# EAGLE schematic Anchor PCB V1 (EAGLE 9.2.0)
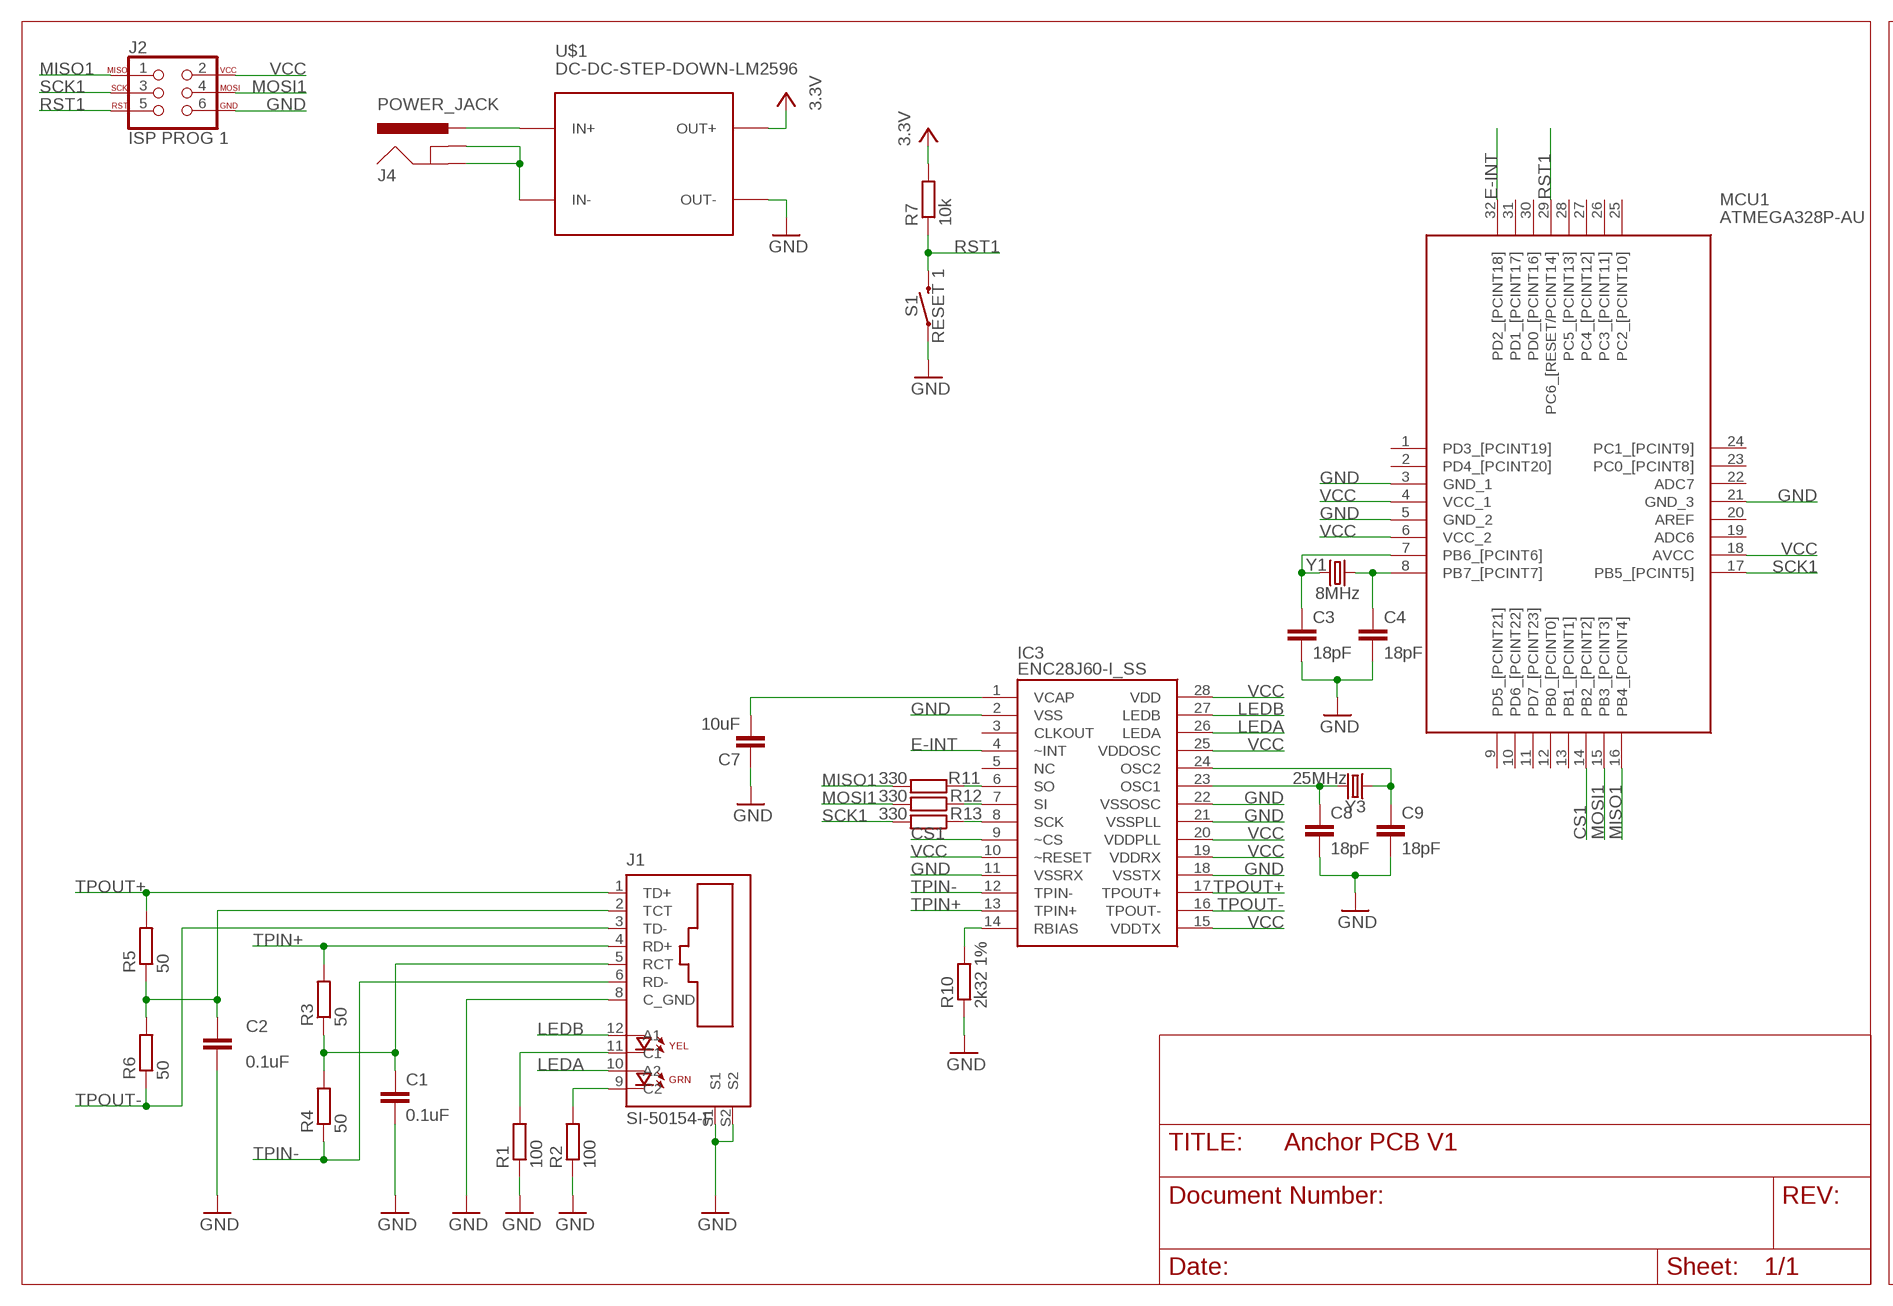
[diagram p0: schematic, sheet 1, part 1 of 2]
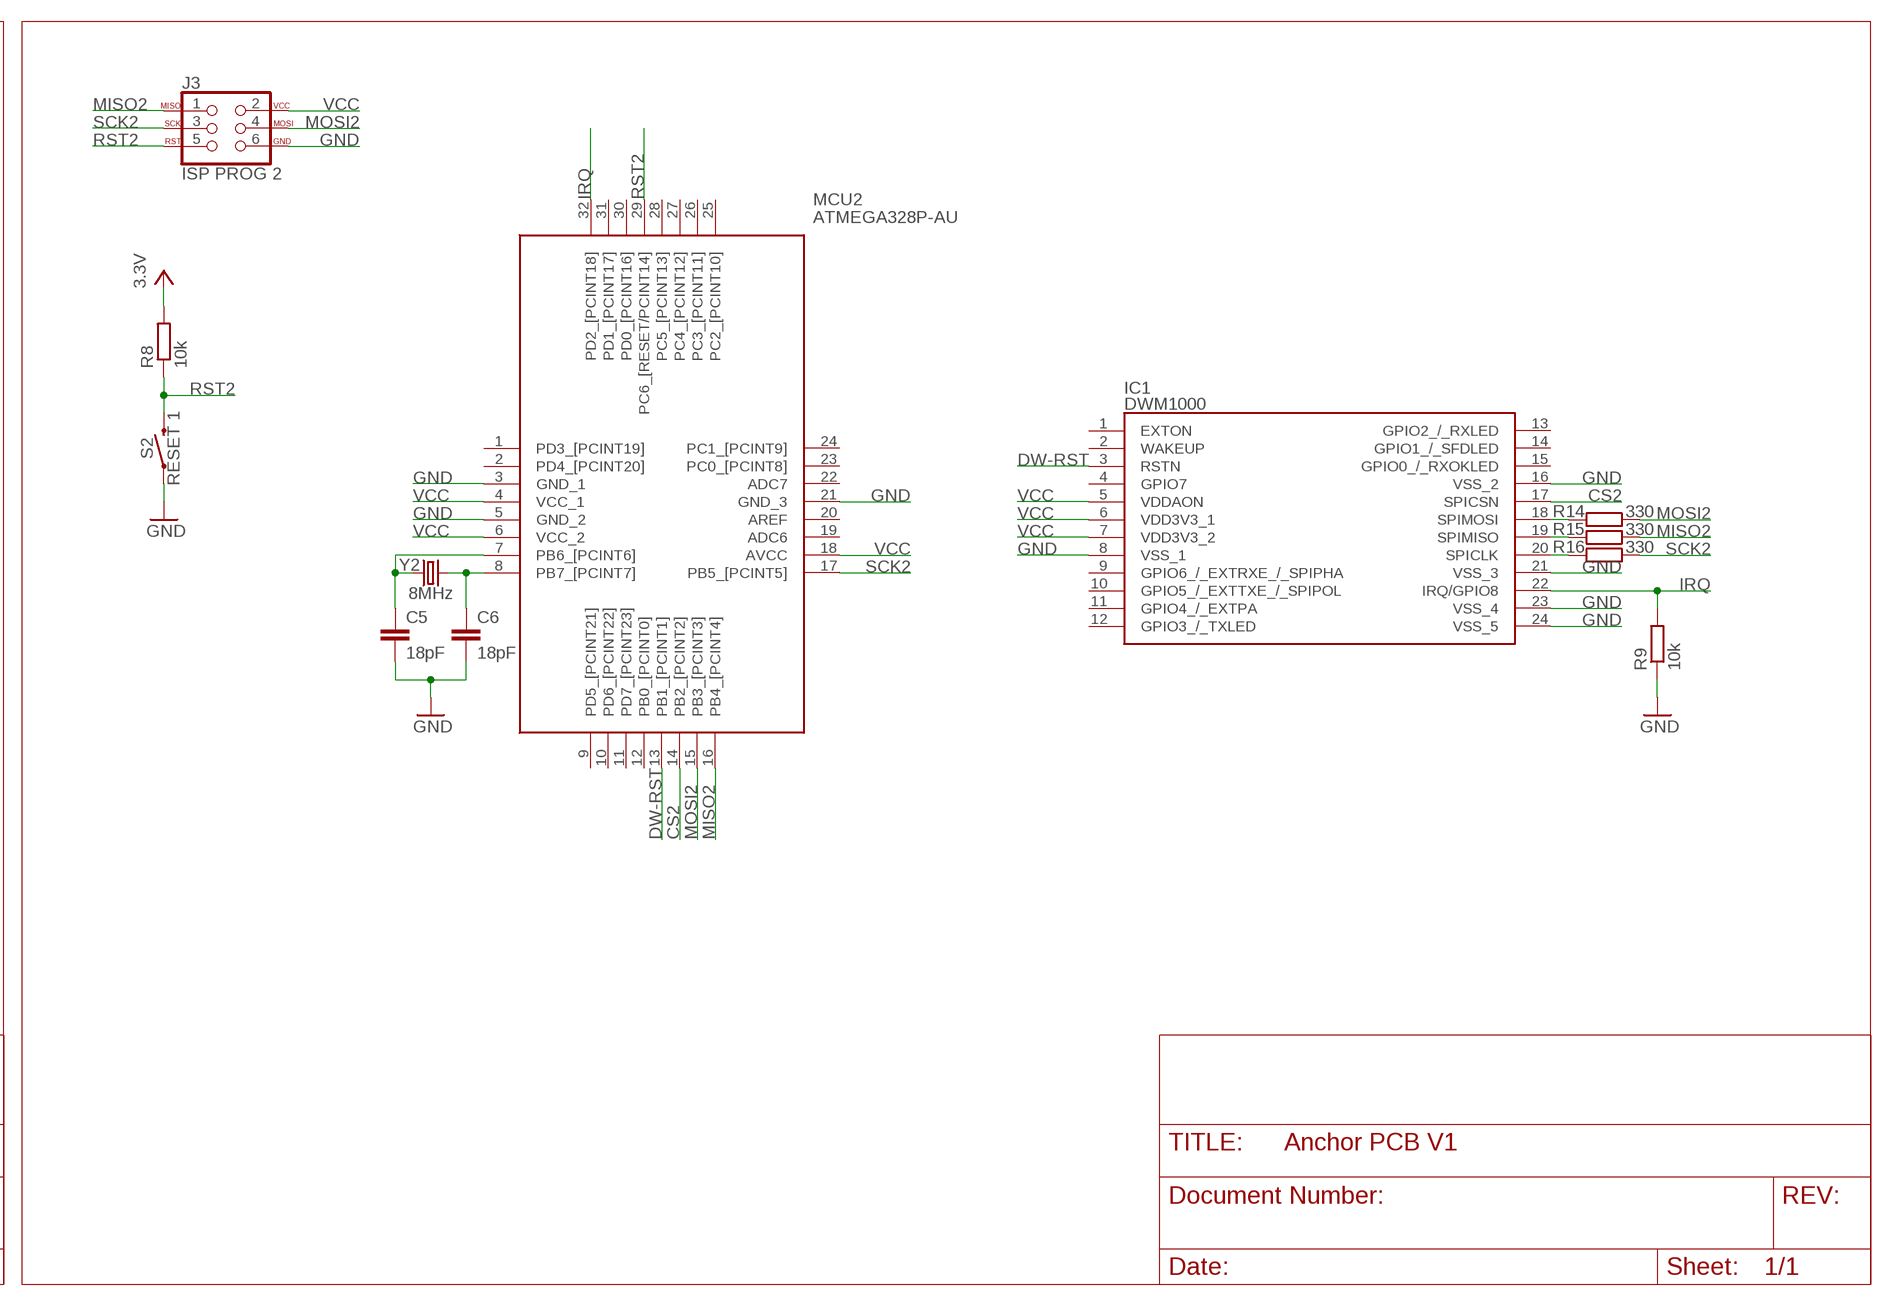
[diagram p1: schematic, sheet 1, part 2 of 2]

## Parts
C1  0.1uF  C-EUC1206  [C1206]
C2  0.1uF  C-EUC1206  [C1206]
C3  18pF  C-EUC1206  [C1206]
C4  18pF  C-EUC1206  [C1206]
C5  18pF  C-EUC1206  [C1206]
C6  18pF  C-EUC1206  [C1206]
C7  10uF  C-EUC1206  [C1206]
C8  18pF  C-EUC1206  [C1206]
C9  18pF  C-EUC1206  [C1206]
IC1  DWM1000  [DWM1000]
IC3  ENC28J60-I_SS  [SOP65P780X200-28N]
J1  SI-50154-F  [STEWART_SI-50154-F]
J2  ISP PROG 1  AVR_SPI_PROG_3X2PTH  [2X3]
J3  ISP PROG 2  AVR_SPI_PROG_3X2PTH  [2X3]
J4  POWER_JACK  [POWER_JACK_PTH]
MCU1  ATMEGA328P-AU  [QFP80P900X900X120-32N]
MCU2  ATMEGA328P-AU  [QFP80P900X900X120-32N]
R1  100  R-EU_R1206  [R1206]
R2  100  R-EU_R1206  [R1206]
R3  50  R-EU_R1206  [R1206]
R4  50  R-EU_R1206  [R1206]
R5  50  R-EU_R1206  [R1206]
R6  50  R-EU_R1206  [R1206]
R7  10k  R-EU_R1206  [R1206]
R8  10k  R-EU_R1206  [R1206]
R9  10k  R-EU_R1206  [R1206]
R10  2k32 1%  R-EU_R1206  [R1206]
R11  330  R-EU_R1206  [R1206]
R12  330  R-EU_R1206  [R1206]
R13  330  R-EU_R1206  [R1206]
R14  330  R-EU_R1206  [R1206]
R15  330  R-EU_R1206  [R1206]
R16  330  R-EU_R1206  [R1206]
S1  RESET 1  MOMENTARY-SWITCH-SPST-PTH-6.0MM  [TACTILE_SWITCH_PTH_6.0MM]
S2  RESET 1  MOMENTARY-SWITCH-SPST-PTH-6.0MM  [TACTILE_SWITCH_PTH_6.0MM]
U$1  DC-DC-STEP-DOWN-LM2596  [DC-DC-STEP-DOWN-LM2596]
Y1  8MHz  CRYSTALPTH-HC49US  [HC49US]
Y2  8MHz  CRYSTALPTH-HC49US  [HC49US]
Y3  25MHz  CRYSTALPTH-HC49US  [HC49US]

## Nets
CS1: IC3.9(~CS) MCU1.14(PB2_[PCINT2])
CS2: IC1.17(SPICSN) MCU2.14(PB2_[PCINT2])
DW-RST: IC1.3(RSTN) MCU2.13(PB1_[PCINT1])
E-INT: IC3.4(~INT) MCU1.32(PD2_[PCINT18])
GND: C1.2 C2.2 C3.2 C4.2 C5.2 C6.2 C7.1 C8.2 C9.2 IC1.8(VSS_1) IC1.16(VSS_2) IC1.21(VSS_3) IC1.23(VSS_4) IC1.24(VSS_5) IC3.2(VSS) IC3.11(VSSRX) IC3.18(VSSTX) IC3.21(VSSPLL) IC3.22(VSSOSC) J1.8(C_GND) J1.S1 J1.S2 J2.6 J3.6 MCU1.3(GND_1) MCU1.5(GND_2) MCU1.21(GND_3) MCU2.3(GND_1) MCU2.5(GND_2) MCU2.21(GND_3) R1.1 R2.1 R9.1 R10.1 S1.1 S2.1 U$1.OUT-
IN+: J4.PWR U$1.IN+
IN-: J4.GND J4.GNDBREAK U$1.IN-
IRQ: IC1.22(IRQ/GPIO8) MCU2.32(PD2_[PCINT18]) R9.2
LEDA: IC3.26(LEDA) J1.10(A2)
LEDB: IC3.27(LEDB) J1.12(A1)
MISO1: J2.1 MCU1.16(PB4_[PCINT4]) R11.2
MISO2: J3.1 MCU2.16(PB4_[PCINT4]) R15.1
MOSI1: J2.4 MCU1.15(PB3_[PCINT3]) R12.2
MOSI2: J3.4 MCU2.15(PB3_[PCINT3]) R14.1
N$1: J1.11(C1) R1.2
N$2: J1.9(C2) R2.2
N$3: C3.1 MCU1.7(PB6_[PCINT6]) Y1.2
N$4: C4.1 MCU1.8(PB7_[PCINT7]) Y1.1
N$5: C5.1 MCU2.7(PB6_[PCINT6]) Y2.1
N$6: C6.1 MCU2.8(PB7_[PCINT7]) Y2.2
N$7: C7.2 IC3.1(VCAP)
N$8: IC3.14(RBIAS) R10.2
N$9: C8.1 IC3.23(OSC1) Y3.2
N$10: C9.1 IC3.24(OSC2) Y3.1
N$11: IC3.6(SO) R11.1
N$12: C1.1 J1.5(RCT) R3.1 R4.2
N$13: C2.1 J1.2(TCT) R5.1 R6.2
N$14: IC3.7(SI) R12.1
N$15: IC3.8(SCK) R13.1
N$16: IC1.18(SPIMOSI) R14.2
N$17: IC1.19(SPIMISO) R15.2
N$18: IC1.20(SPICLK) R16.2
RST1: J2.5 MCU1.29(PC6_[RESET/PCINT14]) R7.1 S1.3
RST2: J3.5 MCU2.29(PC6_[RESET/PCINT14]) R8.1 S2.3
SCK1: J2.3 MCU1.17(PB5_[PCINT5]) R13.2
SCK2: J3.3 MCU2.17(PB5_[PCINT5]) R16.1
TPIN+: IC3.13(TPIN+) J1.4(RD+) R3.2
TPIN-: IC3.12(TPIN-) J1.6(RD-) R4.1
TPOUT+: IC3.17(TPOUT+) J1.1(TD+) R5.2
TPOUT-: IC3.16(TPOUT-) J1.3(TD-) R6.1
VCC: IC1.5(VDDAON) IC1.6(VDD3V3_1) IC1.7(VDD3V3_2) IC3.10(~RESET) IC3.15(VDDTX) IC3.19(VDDRX) IC3.20(VDDPLL) IC3.25(VDDOSC) IC3.28(VDD) J2.2 J3.2 MCU1.4(VCC_1) MCU1.6(VCC_2) MCU1.18(AVCC) MCU2.4(VCC_1) MCU2.6(VCC_2) MCU2.18(AVCC) R7.2 R8.2 U$1.OUT+ ; supply symbol labelled 3.3V
Unconnected: IC1.1(EXTON) IC1.2(WAKEUP) IC1.4(GPIO7) IC1.9(GPIO6_/_EXTRXE_/_SPIPHA) IC1.10(GPIO5_/_EXTTXE_/_SPIPOL) IC1.11(GPIO4_/_EXTPA) IC1.12(GPIO3_/_TXLED) IC1.13(GPIO2_/_RXLED) IC1.14(GPIO1_/_SFDLED) IC1.15(GPIO0_/_RXOKLED) IC3.3(CLKOUT) IC3.5(NC) MCU1.1(PD3_[PCINT19]) MCU1.2(PD4_[PCINT20]) MCU1.9(PD5_[PCINT21]) MCU1.10(PD6_[PCINT22]) MCU1.11(PD7_[PCINT23]) MCU1.12(PB0_[PCINT0]) MCU1.13(PB1_[PCINT1]) MCU1.19(ADC6) MCU1.20(AREF) MCU1.22(ADC7) MCU1.23(PC0_[PCINT8]) MCU1.24(PC1_[PCINT9]) MCU1.25(PC2_[PCINT10]) MCU1.26(PC3_[PCINT11]) MCU1.27(PC4_[PCINT12]) MCU1.28(PC5_[PCINT13]) MCU1.30(PD0_[PCINT16]) MCU1.31(PD1_[PCINT17]) MCU2.1(PD3_[PCINT19]) MCU2.2(PD4_[PCINT20]) MCU2.9(PD5_[PCINT21]) MCU2.10(PD6_[PCINT22]) MCU2.11(PD7_[PCINT23]) MCU2.12(PB0_[PCINT0]) MCU2.19(ADC6) MCU2.20(AREF) MCU2.22(ADC7) MCU2.23(PC0_[PCINT8]) MCU2.24(PC1_[PCINT9]) MCU2.25(PC2_[PCINT10]) MCU2.26(PC3_[PCINT11]) MCU2.27(PC4_[PCINT12]) MCU2.28(PC5_[PCINT13]) MCU2.30(PD0_[PCINT16]) MCU2.31(PD1_[PCINT17])

## Library data of the parts
C1-C9 = rcl:C-EU: CAPACITOR, European symbol; SPICEPREFIX: C
IC1 = DWM1000:DWM1000: IEEE 802.15.4-2011 UWB Transceiver Module Source: Datasheet <http://www.decawave.com/sites/default/files/resources/dwm1000-datasheet-v1.3.pdf>; ARROW_PART_NUMBER: DWM1000; DESCRIPTION: IEEE 802.15.4-2011 UWB Transceiver Module; HEIGHT: mm; MANUFACTURER_NAME: Decawave; MANUFACTURER_PART_NUMBER: DWM1000
IC3 = ENC28J60-I_SS:ENC28J60-I_SS: Stand-Alone Ethernet Controller Source: Datasheet <http://componentsearchengine.com/Datasheets/3/ENC28J60-I_SS.pdf>; ALLIED_NUMBER: 70047510; ALLIED_PRICE-STOCK: https://www.alliedelec.com/microchip-technology-inc-enc28j60-i-ss/70047510/; ARROW_PART_NUMBER: ENC28J60-I/SS; ARROW_PRICE-STOCK: https://www.arrow.com/en/products/enc28j60-iss/microchip-technology; DESCRIPTION: Stand-Alone Ethernet Controller; HEIGHT: mm; MANUFACTURER_NAME: Microchip; MANUFACTURER_PART_NUMBER: ENC28J60-I/SS; RS_PART_NUMBER: 7707755P; RS_PRICE-STOCK: http://uk.rs-online.com/web/p/products/7707755P
J1 = SI-50154-F:SI-50154-F: Conn Telephone/Telecom F 8 POS 2.54mm Solder RA Thru-Hole 12 Terminal 1 Port; AVAILABILITY: Unavailable; DESCRIPTION: Conn RJ-45 Integrated Magnetics F 8 POS 2.54mm Solder RA Thru-Hole 12 Terminal 1 Port; MF: Stewart Connector; MP: SI-50154-F; PACKAGE: None; PRICE: None
J2 J3 = SparkFun-Connectors:AVR_SPI_PROG_3X2: AVR ISP 6 Pin This is the reduced ISP connector for AVR programming. Common on Arduino. This footprint will take up less PCB space and can be used with a 10-pin to 6-pin adapter such as SKU: BOB-08508 **Special note about "TEST_POINT" package. The stop mask is on the top side, so if you want your programming test points to be on the bottom of your board, make sure to place this package on the bottom side of the board. This also ensure that the orientation to program from the bottom side will be correct. SparkFun Products: SparkFun ISP Pogo Adapter <https://www.sparkfun.com/products/11591> - NS Tiny AVR Programmer <https://www.sparkfun.com/products/11801> -PTH
J4 = SparkFun-Connectors:POWER_JACK: Power Jack Connector This is the standard 5.5mm barrel jack for power. The PTH is the most common, proven, reliable, footprint. The Slot footprint only works if the mill layer is transmitted to the PCB fab house so be warned. Here are the connectors we sell at SparkFun: DC Barrel Power Jack/Connector <https://www.sparkfun.com/products/119> (PRT-00119) DC Barrel Power Jack/Connector (SMD) <https://www.sparkfun.com/products/12748> (PRT-12748) DC Barrel Jack Adapter - Breadboard Compatible <https://www.sparkfun.com/products/10811> (PRT-10811) It is used on this SparkFun product (and many, many others): SparkFun RedBoard - Programmed with Arduino <https://www.sparkfun.com/products/12757> (DEV-12757) Also, if you need a mating power supply or connector, please check these out: Wall Adapter Power Supply - 9VDC 650mA <https://www.sparkfun.com/products/298> (TOL-00298) DC Barrel Jack Adapter - Male <https://www.sparkfun.com/products/10287> (PRT-10287); PROD_ID: CONN-08197
MCU1 MCU2 = ATMEGA328P-AU:ATMEGA328P-AU: MICROCHIP - ATMEGA328P-AU. - MICROCONTROLLER MCU, 8 BIT, ATMEGA, 20MHZ, TQFP-32 Source: Datasheet <https://componentsearchengine.com/Datasheets/2/ATMEGA328P-AU.pdf>; ARROW_PART_NUMBER: ATMEGA328P-AU; ARROW_PRICE-STOCK: https://www.arrow.com/en/products/atmega328p-au/microchip-technology; DESCRIPTION: MICROCHIP - ATMEGA328P-AU. - MICROCONTROLLER MCU, 8 BIT, ATMEGA, 20MHZ, TQFP-32; HEIGHT: 1.2mm; MANUFACTURER_NAME: Microchip; MANUFACTURER_PART_NUMBER: ATMEGA328P-AU; RS_PART_NUMBER: 1310271; RS_PRICE-STOCK: http://uk.rs-online.com/web/p/products/1310271
R1-R16 = rcl:R-EU_: RESISTOR, European symbol; SPICEPREFIX: R
S1 S2 = SparkFun-Switches:MOMENTARY-SWITCH-SPST: Momentary Switch (Pushbutton) - SPST Normally-open (NO) SPST momentary switches (buttons, pushbuttons). Variants PTH-12MM - 12mm square, through-hole Momentary Pushbutton Switch - 12mm Square <https://www.sparkfun.com/products/9190> (COM-09190) PTH-6.0MM, PTH-6.0MM-KIT - 6.0mm square, through-hole Mini Pushbutton Switch <https://www.sparkfun.com/products/97> (COM-00097) KIT package intended for soldering kit's - only one side of pads' copper is exposed. PTH-RIGHT-ANGLE-KIT - Right-angle, through-hole Right Angle Tactile Button <https://www.sparkfun.com/products/10791> - Used on SparkFun BigTime Watch Kit <https://www.sparkfun.com/products/11734> SMD-12MM - 12mm square, surface-mount Tactile Button - SMD (12mm) <https://www.sparkfun.com/products/12993> (COM-12993) Used on SparkFun PicoBoard <https://www.sparkfun.com/products/11888> SMD-4.5MM - 4.5mm Square Trackball Switch Used on SparkFun Blackberry Trackballer Breakout <https://www.sparkfun.com/products/13169> SMD-4.6MMX2.8MM - 4.60mm x 2.80mm, surface mount Used on SparkFun SAMD21 Mini Breakout <https://www.sparkfun.com/products/13664> SMD-5.2MM, SMD-5.2-REDUNDANT - 5.2mm square, surface-mount Mini Pushbutton Switch - SMD <https://www.sparkfun.com/products/8720> (COM-08720) Used on Arduino Pro Mini <https://www.sparkfun.com/products/11114> REDUNDANT package connects both switch circuits together SMD-6.0X3.5MM - 6.0 x 3.5mm, surface mount Momentary Reset Switch SMD <https://www.sparkfun.com/products/8229> (COM-08229) SMD-6.2MM-TALL - 6.2mm square, surface mount Tactile Button - SMD (6mm) <https://www.sparkfun.com/products/12992> Used on SparkFun Digital Sandbox <https://www.sparkfun.com/products/12651> SMD-RIGHT-ANGLE - Right-angle, surface mount Used on SparkFun Block for Intel® Edison - Arduino <https://www.sparkfun.com/products/13036>; PROD_ID: SWCH-08441; SF_SKU: COM-00097
U$1 = 1484249208697-powermodules:DC-DC-STEP-DOWN-LM2596: DC/DC Step-Down Regulator based on LM2596-ADJ chip
Y1-Y3 = SparkFun-Clocks:CRYSTAL: Crystals (Generic) These are passive quartz crystals, which can be used as a clock source for a microcontroller. Crystal's are two-terminal devices. They require external "load" capacitors to generate an oscillating signal.